# Altium schematic sheet Buttons.schdoc
size 292 x 193 mm; Opracowal: Martyna Stankiewicz; projRevision: KD; Author: Martyna Stankiewicz; CompanyName: Politechnika Warszawska; Organization: EITI; Address1: Nowowiejska 15/19; Address2: 00-665 Warszawa; Revision: KD; SheetNumber: 6; SheetTotal: 8; HTTPLink: www.pw.edu.pl
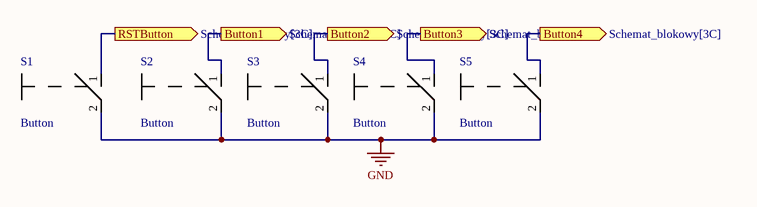
[diagram p0: Buttons.schdoc]

## Parts
S1  Button  [SW_TL59NF160Q]
S2  Button  [SW_TL59NF160Q]
S3  Button  [SW_TL59NF160Q]
S4  Button  [SW_TL59NF160Q]
S5  Button  [SW_TL59NF160Q]

## Ports
Button1 (out, see Schemat_blokowy[3C]), Button2 (out, see Schemat_blokowy[3C]), Button3 (out, see Schemat_blokowy[3C]), Button4 (out, see Schemat_blokowy[3C]), RSTButton (out, see Schemat_blokowy[3C])

## Nets
GND: S1.2 S2.2 S3.2 S4.2 S5.2
Button1: S2.1 ; port Button1
Button2: S3.1 ; port Button2
Button3: S4.1 ; port Button3
Button4: S5.1 ; port Button4
RSTButton: S1.1 ; port RSTButton

## Notes on the sheet
- Data:
- Tytuł:
- Rev.:
- Rozm.:
- A4
- Strona:
- z
- PBL4
- Opracował:

## Library data of the parts
S1-S5 = Button: PartNumber: TL59NF160Q